# Altium schematic sheet RES Receiver19D.SchDoc: RES Receiver19D
size A3; Author: Chen zhipu; DrawnBy: Chen zhipu; SheetNumber: 1; SheetTotal: 1
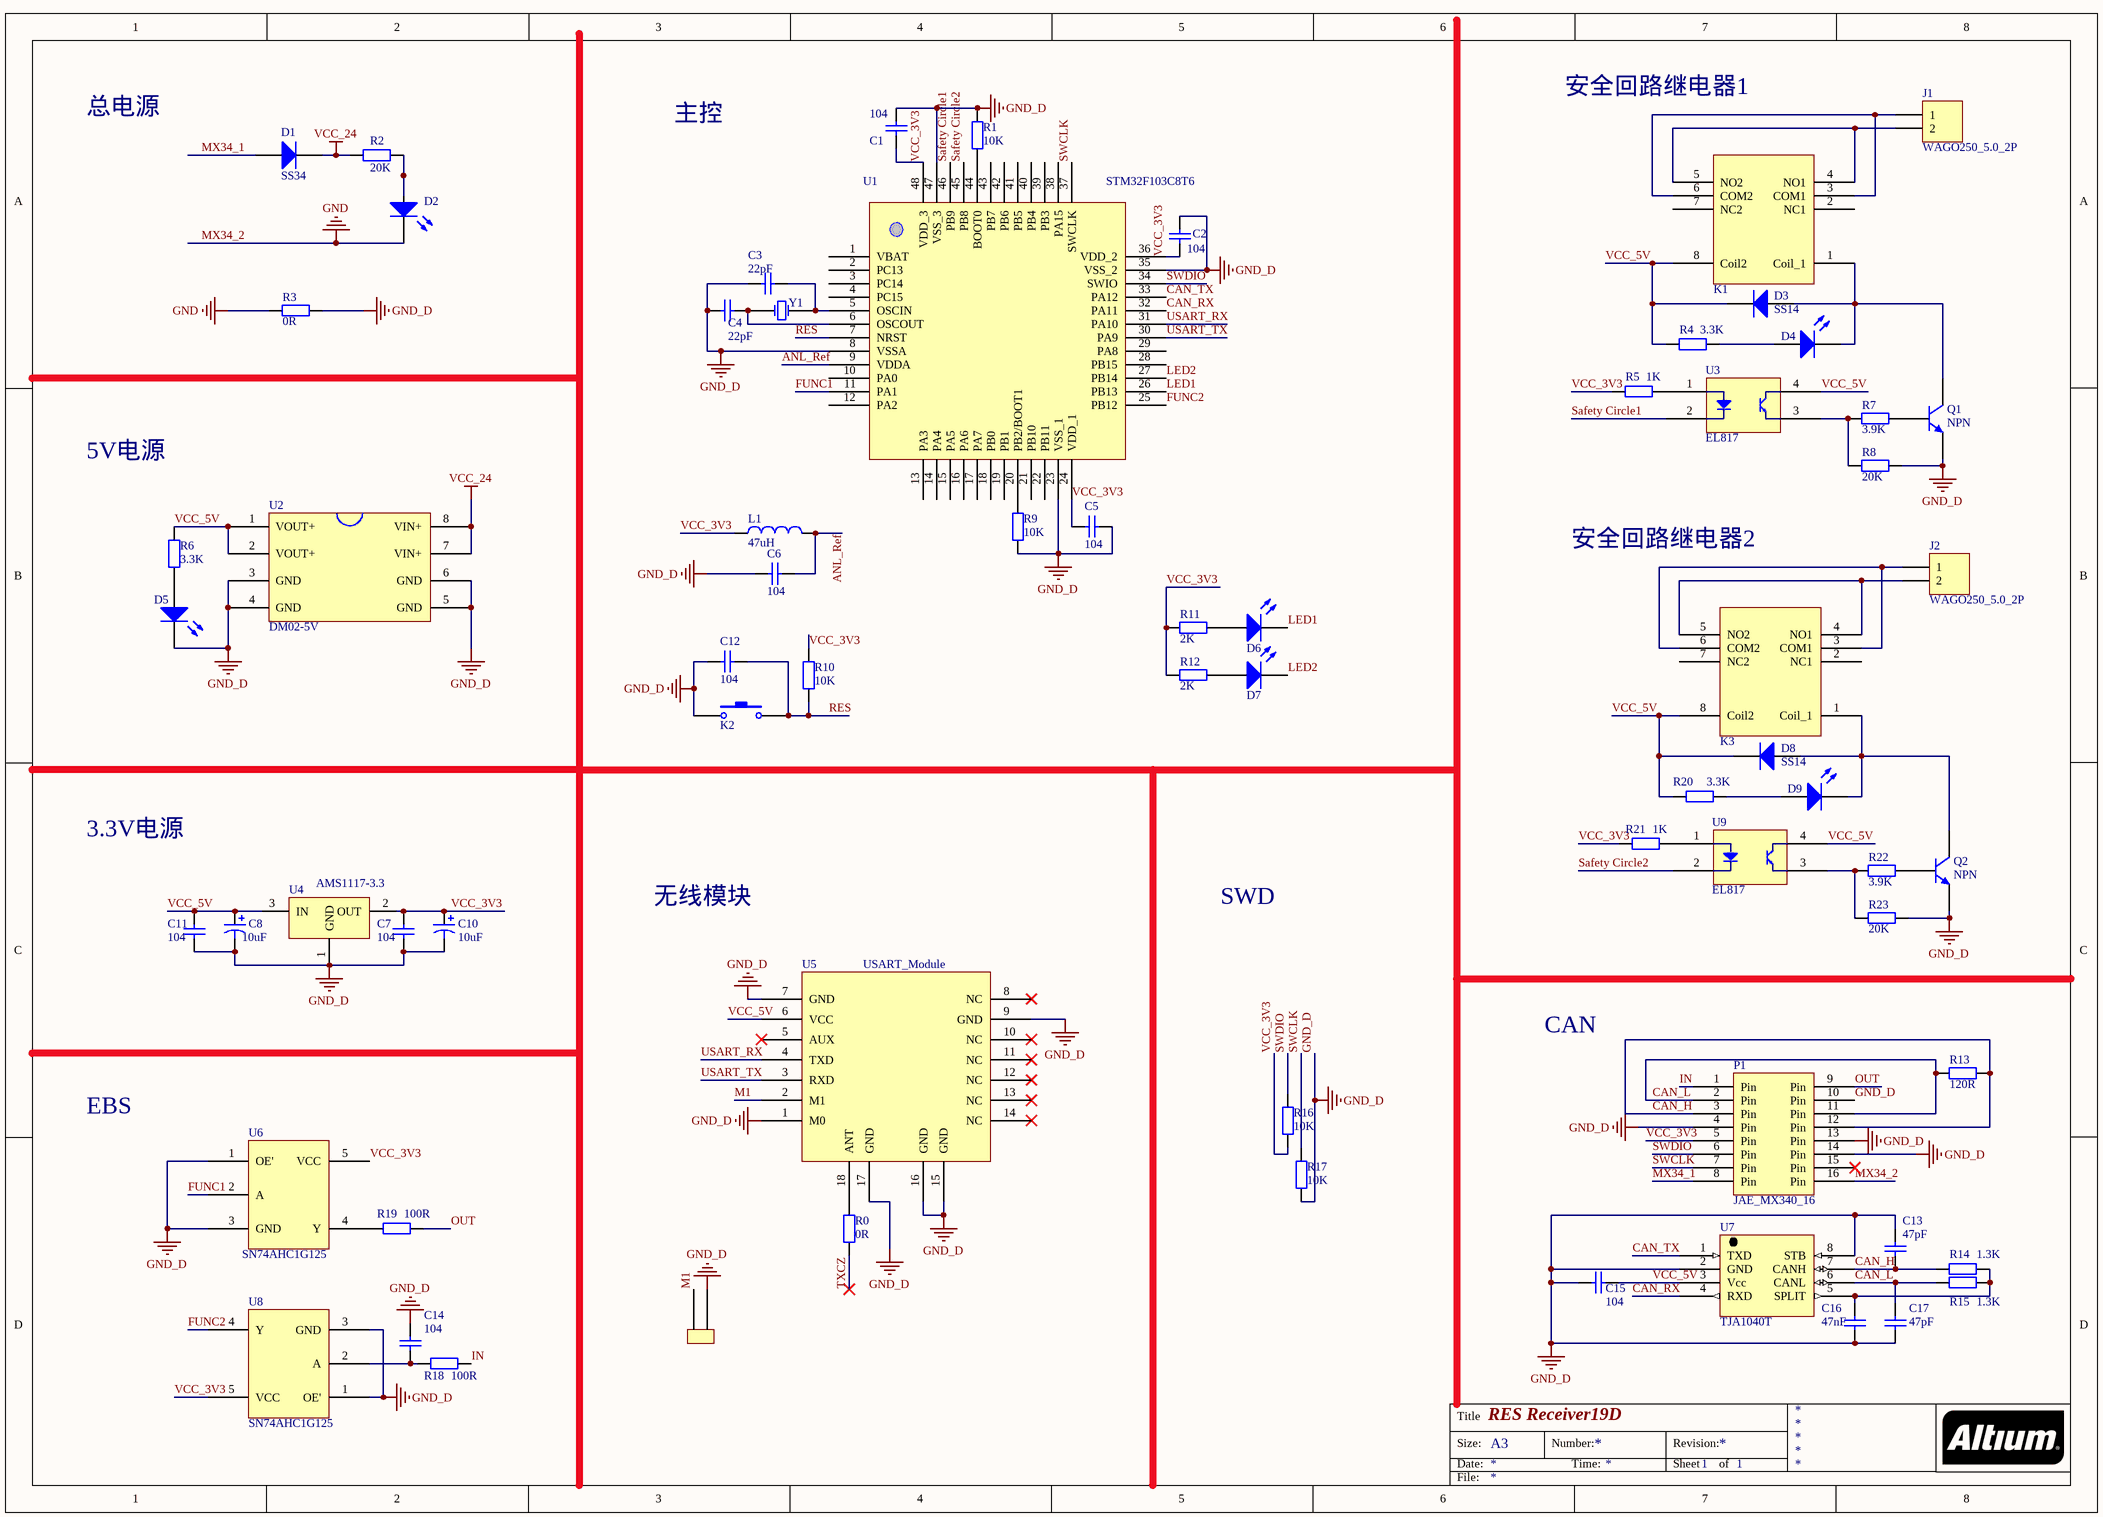
[diagram p0: RES Receiver19D.SchDoc]

## Parts
C1  value 104  [C 0805]  (hidden comment: Cap vol)
C2  value 104  [C 0805]  (hidden comment: Cap vol)
C3  value 22pF  [C 0805]  (hidden comment: Cap vol)
C4  value 22pF  [C 0805]  (hidden comment: Cap vol)
C5  value 104  [C 0805]  (hidden comment: Cap vol)
C6  value 104  [C 0805]  (hidden comment: Cap vol)
C7  Cap vol  [C 0805]  (value not drawn)
C8  Cap vol  [CP 3528B]  (value not drawn)
C10  Cap vol  [CP 3528B]  (value not drawn)
C11  Cap vol  [C 0805]  (value not drawn)
C12  value 104  [C 0805]  (hidden comment: Cap vol)
C13  value 47pF  [C 0805]  (hidden comment: Cap vol)
C14  value 104  [C 0805]  (hidden comment: Cap vol)
C15  value 104  [C 0805]  (hidden comment: Cap vol)
C16  value 47nF  [C 0805]  (hidden comment: Cap vol)
C17  value 47pF  [C 0805]  (hidden comment: Cap vol)
D1  SS34  [DO-214]
D2  Color  [LED_0805]  (value not drawn)
D3  SS14  [DO-214]
D4  Color  [LED_0805]  (value not drawn)
D5  Color  [LED_0805]  (value not drawn)
D6  Color  [LED_0805]  (value not drawn)
D7  Color  [LED_0805]  (value not drawn)
D8  SS14  [DO-214]
D9  Color  [LED_0805]  (value not drawn)
J1  WAGO250_5.0_2P  [WAGO250_5.0_2P]
J2  WAGO250_5.0_2P  [WAGO250_5.0_2P]
K1  Coil Voltage  [Telecom Relay]  (value not drawn)
K2  Key  [KEY 3.6*2.5 SMD]  (value not drawn)
K3  Coil Voltage  [Telecom Relay]  (value not drawn)
L1  value 47uH  [L 0805]  (hidden comment: Inductor)
M1  PZ  [PZ]  (value not drawn)
P1  JAE_MX340_16  [JAE_MX34_2.2_16]
Q1  NPN  [SOT23-3]
Q2  NPN  [SOT23-3]
R0  Res  [R 0805]  (value not drawn)
R1  value 10K  [R 0805]  (hidden comment: Res)
R2  Res  [R 0805]  (value not drawn)
R3  Res  [R 1206]  (value not drawn)
R4  value 3.3K  [R 0805]  (hidden comment: Res)
R5  value 1K  [R 0805]  (hidden comment: Res)
R6  value 3.3K  [R 0805]  (hidden comment: Res)
R7  Res  [R 0805]  (value not drawn)
R8  Res  [R 0805]  (value not drawn)
R9  value 10K  [R 0805]  (hidden comment: Res)
R10  value 10K  [R 0805]  (hidden comment: Res)
R11  value 2K  [R 0805]  (hidden comment: Res)
R12  value 2K  [R 0805]  (hidden comment: Res)
R13  value 120R  [R 0805]  (hidden comment: Res)
R14  value 1.3K  [R 0805]  (hidden comment: Res)
R15  value 1.3K  [R 0805]  (hidden comment: Res)
R16  value 10K  [R 0805]  (hidden comment: Res)
R17  value 10K  [R 0805]  (hidden comment: Res)
R18  value 100R  [R 0805]  (hidden comment: Res)
R19  value 100R  [R 0805]  (hidden comment: Res)
R20  value 3.3K  [R 0805]  (hidden comment: Res)
R21  value 1K  [R 0805]  (hidden comment: Res)
R22  Res  [R 0805]  (value not drawn)
R23  Res  [R 0805]  (value not drawn)
U1  STM32F103C8T6  [LQFP48]
U2  DM02-5V  [DM02]
U3  EL817  [SOP4]
U4  AMS1117-3.3  [SOT223]
U5  USART_Module  [USART_Module]
U6  SN74AHC1G125  [SOT23-5]
U7  TJA1040T  [SOP8]
U8  SN74AHC1G125  [SOT23-5]
U9  EL817  [SOP4]
Y1  Freq  [XTAL-5032]  (value not drawn)

## Nets
GND_D: C1.2 C2.1 C3.1 C4.1 C5.2 C6.1 C7.1 C8.2 C10.2 C11.1 C12.1 C13.2 C14.2 C15.1 C16.1 C17.1 D5.2(K) K2.1 M1.2 P1.4(Pin) P1.10(Pin) P1.13(Pin) P1.14(Pin) Q1.2(E) Q2.2(E) R1.2 R3.2 R8.1 R9.1 R17.1 R23.1 U1.8(VSSA) U1.23(VSS_1) U1.35(VSS_2) U1.47(VSS_3) U2.3(GND) U2.4(GND) U2.5(GND) U2.6(GND) U4.1(GND) U5.1(M0) U5.7(GND) U5.9(GND) U5.15(GND) U5.16(GND) U5.17(GND) U6.1(OE') U6.3(GND) U7.2(GND) U7.8(STB) U8.1(OE') U8.3(GND)
MX34_2: D2.2(K) P1.16(Pin) R3.1  [also labelled GND]
VCC_24: D1.2(K) R2.1 U2.7(VIN+) U2.8(VIN+)
ANL_Ref: C6.2 L1.2 U1.9(VDDA)
CAN_H: C13.1 P1.3(Pin) P1.12(Pin) R13.1 R14.1 U7.7(CANH)
CAN_L: C17.2 P1.2(Pin) P1.11(Pin) R13.2 R15.1 U7.6(CANL)
CAN_RX: U1.32(PA11) U7.4(RXD)
CAN_TX: U1.33(PA12) U7.1(TXD)
FUNC1: U1.11(PA1) U6.2(A)
FUNC2: U1.25(PB12) U8.4(Y)
IN: P1.1(Pin) R18.2
LED1: D6.2(K) U1.26(PB13)
LED2: D7.2(K) U1.27(PB14)
M1: M1.1 U5.2(M1)
MX34_1: D1.1(A) P1.8(Pin)
OUT: P1.9(Pin) R19.2
RES: C12.2 K2.2 R10.1 U1.7(NRST)
Safety Circle1: U1.46(PB9) U3.2
Safety Circle2: U1.45(PB8) U9.2
SWCLK: P1.7(Pin) R17.2 U1.37(SWCLK)
SWDIO: P1.6(Pin) R16.2 U1.34(SWIO)
TXCZ: R0.2
USART_RX: U1.31(PA10) U5.4(TXD)
USART_TX: U1.30(PA9) U5.3(RXD)
VCC_3V3: C1.1 C2.2 C5.1 C7.2 C10.1 L1.1 P1.5(Pin) R5.1 R10.2 R11.1 R12.1 R16.1 R21.1 U1.24(VDD_1) U1.36(VDD_2) U1.48(VDD_3) U4.2(OUT) U6.5(VCC) U8.5(VCC)
VCC_5V: C8.1 C11.2 C15.2 D3.2(K) D8.2(K) K1.8(Coil2) K3.8(Coil2) R4.1 R6.2 R20.1 U2.1(VOUT+) U2.2(VOUT+) U3.4 U4.3(IN) U5.6(VCC) U7.3(Vcc) U9.4
NetC3_2: C3.2 U1.5(OSCIN) Y1.1(OSC1)
NetC4_2: C4.2 U1.6(OSCOUT) Y1.2(OSC2)
NetC14_1: C14.1 R18.1 U8.2(A)
NetC16_2: C16.2 R14.2 R15.2 U7.5(SPLIT)
NetD2_1: D2.1(A) R2.2
NetD3_1: D3.1(A) D4.2(K) K1.1(Coil_1) Q1.3(C)
NetD4_1: D4.1(A) R4.2
NetD5_1: D5.1(A) R6.1
NetD6_1: D6.1(A) R11.2
NetD7_1: D7.1(A) R12.2
NetD8_1: D8.1(A) D9.2(K) K3.1(Coil_1) Q2.3(C)
NetD9_1: D9.1(A) R20.2
NetJ1_1: J1.1 K1.3(COM1) K1.6(COM2)
NetJ1_2: J1.2 K1.4(NO1) K1.5(NO2)
NetJ2_1: J2.1 K3.3(COM1) K3.6(COM2)
NetJ2_2: J2.2 K3.4(NO1) K3.5(NO2)
NetQ1_1: Q1.1(B) R7.1
NetQ2_1: Q2.1(B) R22.1
NetR0_1: R0.1 U5.18(ANT)
NetR1_1: R1.1 U1.44(BOOT0)
NetR5_2: R5.2 U3.1
NetR7_2: R7.2 R8.2 U3.3
NetR9_2: R9.2 U1.20(PB2/BOOT1)
NetR19_1: R19.1 U6.4(Y)
NetR21_2: R21.2 U9.1
NetR22_2: R22.2 R23.2 U9.3

Not connected (* = marked no-connect by the designer): K1 2(NC1) 7(NC2); K3 2(NC1) 7(NC2); P1 15(Pin)*; U1 1(VBAT) 2(PC13) 3(PC14) 4(PC15) 10(PA0) 12(PA2) 13(PA3) 14(PA4) 15(PA5) 16(PA6) 17(PA7) 18(PB0) 19(PB1) 21(PB10) 22(PB11) 28(PB15) 29(PA8) 38(PA15) 39(PB3) 40(PB4) 41(PB5) 42(PB6) 43(PB7); U5 5(AUX)* 8(NC)* 10(NC)* 11(NC)* 12(NC)* 13(NC)* 14(NC)*

## Notes on the sheet
- 总电源
- 安全回路继电器1
- 主控
- 5V电源
- 安全回路继电器2
- 3.3V电源
- 无线模块
- SWD
- CAN
- EBS
- Title
- Size:
- Date:
- A3
- Number:
- Time:
- Revision:
- Sheet
- of
- File:
- (in symbol Cap) 104
- (in symbol Cap_Pol) 10uF
- (in symbol Resistor) 20K; 0R; 3.9K

## Library data of the parts
C1-C7 C11-C17 = Cap: 无极性电容
C8 C10 = Cap_Pol: 极性电容
D1 D3 D8 = Diode: 二极管
D2 D4-D7 D9 = LED: 发光二极管
J1 J2 = WAGO250_5.0_2P: 快接端子
K1 K3 = Telecom Relay: 电信继电器;2 CHs; 30V 8A Max.
K2 = Key: 按键
L1 = Inductor: 电感
P1 = JAE_MX34016NF1
Q1 Q2 = Transistor_NPN: NPN三极管
R0-R23 = Resistor: 电阻
U1 = STM32F103C8T6: Micro controller
U2 = DM02: 开关型DC-DC变换器
U3 U9 = EL817: 光耦
U4 = AMS1117: 线性稳压器
U6 U8 = SN74AHC1G125: 单路缓冲器、三态门
U7 = TJA1040T: 高速CAN收发器
Y1 = XTAL: 晶振